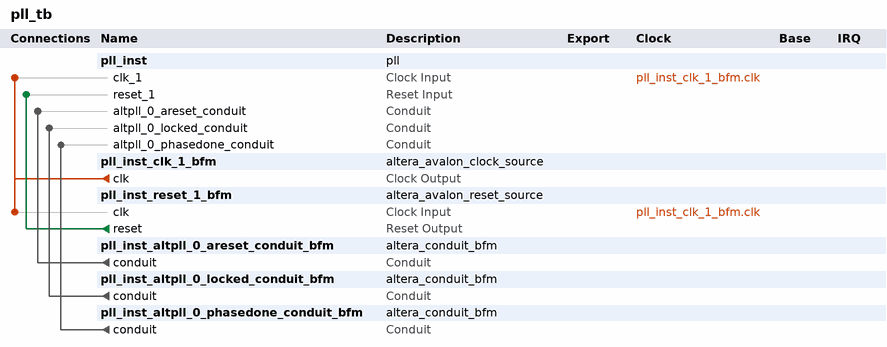
[diagram p0: system contents]
# Platform Designer (Qsys) system pll_tb, Cyclone III EP3C5E144C8
# Parameters at their usual value, and those the tool derives, are not listed.
package require -exact qsys 13.0
create_system pll_tb
set_project_property DEVICE_FAMILY {Cyclone III}
set_project_property DEVICE EP3C5E144C8

add_instance pll_inst pll 1.0

add_instance pll_inst_clk_1_bfm altera_avalon_clock_source 13.0

add_instance pll_inst_reset_1_bfm altera_avalon_reset_source 13.0
set_instance_parameter_value pll_inst_reset_1_bfm ASSERT_HIGH_RESET 1
set_instance_parameter_value pll_inst_reset_1_bfm INITIAL_RESET_CYCLES 50

add_instance pll_inst_altpll_0_areset_conduit_bfm altera_conduit_bfm 13.0
set_instance_parameter_value pll_inst_altpll_0_areset_conduit_bfm CLOCKED_SIGNAL false
set_instance_parameter_value pll_inst_altpll_0_areset_conduit_bfm ENABLE_RESET false
set_instance_parameter_value pll_inst_altpll_0_areset_conduit_bfm SIGNAL_WIDTHS 1
set_instance_parameter_value pll_inst_altpll_0_areset_conduit_bfm SIGNAL_DIRECTIONS output

add_instance pll_inst_altpll_0_locked_conduit_bfm altera_conduit_bfm 13.0
set_instance_parameter_value pll_inst_altpll_0_locked_conduit_bfm CLOCKED_SIGNAL false
set_instance_parameter_value pll_inst_altpll_0_locked_conduit_bfm ENABLE_RESET false
set_instance_parameter_value pll_inst_altpll_0_locked_conduit_bfm SIGNAL_WIDTHS 1
set_instance_parameter_value pll_inst_altpll_0_locked_conduit_bfm SIGNAL_DIRECTIONS input

add_instance pll_inst_altpll_0_phasedone_conduit_bfm altera_conduit_bfm 13.0
set_instance_parameter_value pll_inst_altpll_0_phasedone_conduit_bfm CLOCKED_SIGNAL false
set_instance_parameter_value pll_inst_altpll_0_phasedone_conduit_bfm ENABLE_RESET false
set_instance_parameter_value pll_inst_altpll_0_phasedone_conduit_bfm SIGNAL_WIDTHS 1
set_instance_parameter_value pll_inst_altpll_0_phasedone_conduit_bfm SIGNAL_DIRECTIONS input

# connections
add_connection pll_inst_clk_1_bfm.clk pll_inst.clk_1 clock
add_connection pll_inst_clk_1_bfm.clk pll_inst_reset_1_bfm.clk clock
add_connection pll_inst_reset_1_bfm.reset pll_inst.reset_1 reset
add_connection pll_inst_altpll_0_areset_conduit_bfm.conduit pll_inst.altpll_0_areset_conduit conduit
add_connection pll_inst_altpll_0_locked_conduit_bfm.conduit pll_inst.altpll_0_locked_conduit conduit
add_connection pll_inst_altpll_0_phasedone_conduit_bfm.conduit pll_inst.altpll_0_phasedone_conduit conduit

set_interconnect_requirement {$system} qsys_mm.clockCrossingAdapter HANDSHAKE
set_interconnect_requirement {$system} qsys_mm.maxAdditionalLatency 1

save_system pll_tb.qsys
